# Altium project ControllerPCB.PrjPcb (part 2 of 2)

## Sheet Power.SchDoc
size A3; Date: 01/12/2021; DrawnBy: Can Güveren; SheetNumber: 4; SheetTotal: 4; PageSize: A3
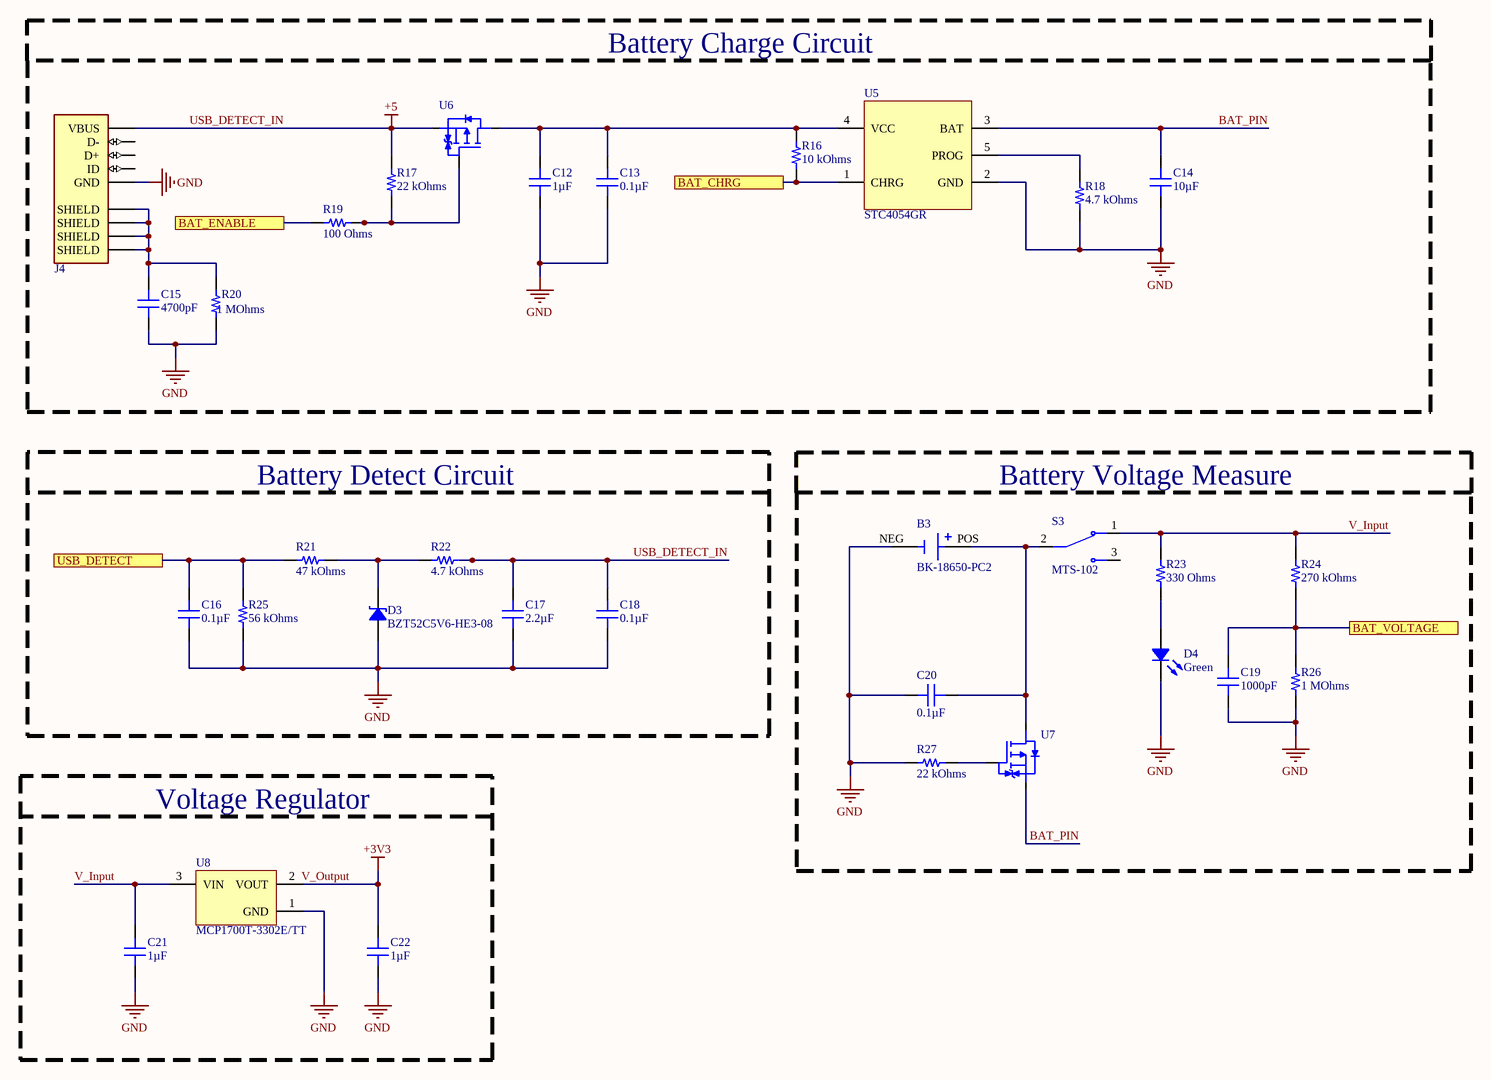
[diagram p3: Power.SchDoc]

### Parts
B3  BK-18650-PC2  [BK-16850-PC2]
C12  1µF  [CAP 0603_1608]
C13  0.1µF  [CAP 0603_1608]
C14  10µF  [CAP 0603_1608]
C15  4700pF  [CAP 0603_1608]
C16  0.1µF  [CAP 0603_1608]
C17  2.2µF  [CAP 0603_1608]
C18  0.1µF  [CAP 0603_1608]
C19  1000pF  [CAP 0603_1608]
C20  0.1µF  [CAP 0603_1608]
C21  1µF  [CAP 0603_1608]
C22  1µF  [CAP 0603_1608]
D3  BZT52C5V6-HE3-08  [SOD-123]
D4  Green  [LED 1206_3216 YELLOW]
J4  USB2066-05-RBHM-15-STB-00-00-A  [USB Mini-B]  (value not drawn)
R16  10 kOhms  [RES 0603_1608]
R17  22 kOhms  [RES 0603_1608]
R18  4.7 kOhms  [RES 0603_1608]
R19  100 Ohms  [RES 0603_1608]
R20  1 MOhms  [RES 0603_1608]
R21  47 kOhms  [RES 0603_1608]
R22  4.7 kOhms  [RES 0603_1608]
R23  330 Ohms  [RES 0603_1608]
R24  270 kOhms  [RES 0603_1608]
R25  56 kOhms  [RES 0603_1608]
R26  1 MOhms  [RES 0603_1608]
R27  22 kOhms  [RES 0603_1608]
S3  MTS-102  [MTS-102 (Toggle)]
U5  STC4054GR  [TSOT-23]
U6  SSM3J338R,LF  [SOT-23-3]  (value not drawn)
U7  SSM3J338R,LF  [SOT-23-3]  (value not drawn)
U8  MCP1700T-3302E/TT  [SOT-23-3]

### Blocks framed on the sheet
Battery Charge Circuit: C12-C15 J4 R16-R20 U5 U6
Battery Detect Circuit: C16-C18 D3 R21 R22 R25
Battery Voltage Measure: B3 C19 C20 D4 R23 R24 R26 R27 S3 U7
Voltage Regulator: C21 C22 U8

### Ports
BAT_CHRG, BAT_ENABLE, BAT_VOLTAGE, USB_DETECT

### Nets
GND: B3.NEG C12.1 C13.1 C14.1 C15.1 C16.1 C17.1 C18.1 C19.1 C20.1 C21.1 C22.1 D3.1 D4.2 J4.5(GND) R18.1 R20.1 R25.1 R26.1 R27.1 U5.2(GND) U8.1(GND)
USB_DETECT_IN: C17.2 C18.2 J4.1(VBUS) R17.2 R22.1 U6.2(S)  [also labelled +5]
V_Output: C22.2 U8.2(VOUT)  [also labelled +3V3]
BAT_PIN: C14.2 U5.3(BAT) U7.2(S)
V_Input: C21.2 R23.2 R24.2 S3.1 U8.3(VIN)
NetB3_POS: B3.POS C20.2 S3.2 U7.3(D)
NetC12_2: C12.2 C13.2 R16.2 U5.4(VCC) U6.3(D)
NetC15_2: C15.2 J4.6(SHIELD) J4.7(SHIELD) J4.8(SHIELD) J4.9(SHIELD) R20.2
NetC16_2: C16.2 R21.1 R25.2 ; port USB_DETECT
NetC19_2: C19.2 R24.1 R26.2 ; port BAT_VOLTAGE
NetD3_2: D3.2 R21.2 R22.2
NetD4_1: D4.1 R23.1
NetR16_1: R16.1 U5.1(CHRG) ; port BAT_CHRG
NetR17_1: R17.1 R19.2 U6.1(G)
NetR18_2: R18.2 U5.5(PROG)
NetR19_1: R19.1 ; port BAT_ENABLE
NetR27_2: R27.2 U7.1(G)

Not connected (* = marked no-connect by the designer): J4 2(D-) 3(D+) 4(ID); S3 3

### Notes on the sheet
- Project Name
- Draw By
- Date
- Size
- Number

### Library data of the parts
B3 = BK-18650-PC2: Battery Holder 18650 Pc Pin; Manufacturer: Memory Protection Devices; Number of Cells: 1; Supplier 1: Digi-Key; Manufacturer Part Number: BK-18650-PC2; RoHS: Yes; Category: Uncategorized; Stock 1: 7372; Pricing 1: 1=3,64000, 10=3,06200, 50=2,68780, 100=2,53120, 250=2,32628, 500=2,18166, 1000=2,03701, 2500=1,84416, 5000=1,66336 (USD); Mount: Through Hole,PCB; Package Quantity: 100; Termination: PC Pin; ComponentLink1URL: https://datasheet.ciiva.com/3/bk-18650-pc2-datasheet-3879.pdf?src-supplier=Digi-Key; ComponentLink1Description: https://datasheet.ciiva.com/3/bk-18650-pc2-datasheet-3879.pdf?src-supplier=Digi-Key; Supplier Part Number 1: BK-18650-PC2-ND
C12 C21 C22 = C0603C105K4RACAUTO: CAP CER 0603 1UF 16V X7R 10%; Manufacturer: KEMET; Part Number: C0603C105K4RACAUTO; Value: 1µF; Applications: Automotive, Bypass, Decoupling; Capacitance: 1µF; ComponentLink1Description: Datasheet; ComponentLink1URL: https://api.kemet.com/component-edge/download/datasheet/C0603C105K4RACAUTO.pdf; ComponentLink2Description: DigiKey Link; ComponentLink2URL: http://digikey.com/product-detail/en/kemet/C0603C105K4RACAUTO/399-17704-1-ND/8635855; Device Package: 0603 (1608 Metric); LastUpdated: 2.09.2020 01:03:36; Lifecycle Status: Active; Minimum Order: 1; Mounting Type: Surface Mount, MLCC; Operating Temperature: -55°C ~ 125°C; Package / Case: 0603 (1608 Metric); Packaging: TapeAndReel; PartId: 2179; Part Status: Active; Price: 0.02; Ratings: AEC-Q200; Series: SMD Auto X7R; Size / Dimension: 0.063" L x 0.031" W (1.60mm x 0.80mm); Supplier 1: DigiKey; Supplier Part Number 1: 399-17704-1-ND; Temperature Coefficient: X7R; Thickness (Max): 0.037" (0.95mm); Tolerance: ±10%; Voltage - Rated: 16V
C13 C16 C18 C20 = 0603Y0160104KXT: CAP CER 0.10UF 16V X7R 0603; Manufacturer: Knowles Syfer; Temperature Coefficient: X7R (2R1); Tolerance: ±10%; Part Number: 0603Y0160104KXT; Value: 0.1µF; Applications: High Reliability, Boardflex Sensitive; Capacitance: 0.1µF; ComponentLink1Description: Datasheet; ComponentLink1URL: https://www.knowlescapacitors.com/getattachment/2dbfc8bc-e2b3-4b4d-afb1-43b011b9ebe0/High-Std-Voltage.aspx; ComponentLink2Description: DigiKey Link; ComponentLink2URL: http://digikey.com/product-detail/en/knowles-syfer/0603Y0160104KXT/1608-1363-1-ND/7644465; Device Package: 0603 (1608 Metric); Features: Soft Termination, High Temperature; LastUpdated: 2.09.2020 01:03:34; Lifecycle Status: Active; Minimum Order: 1; Mounting Type: Surface Mount, MLCC; Operating Temperature: -55°C ~ 125°C; Package / Case: 0603 (1608 Metric); Packaging: TapeAndReel; PartId: 2921; Part Status: Active; Price: 0.16; Series: FlexiCap™; Size / Dimension: 0.063" L x 0.031" W (1.60mm x 0.80mm); Supplier 1: DigiKey; Supplier Part Number 1: 1608-1363-1-ND; Thickness (Max): 0.031" (0.80mm); Voltage - Rated: 16V
C14 = GRM188R60J106ME47D: CAP CER 10UF 6.3V X5R 0603; Manufacturer: Murata Electronics; Tolerance: ±20%; Part Number: GRM188R60J106ME47D; Value: 10µF; Applications: General Purpose; Capacitance: 10µF; ComponentLink1Description: Datasheet; ComponentLink1URL: https://www.murata.com/~/media/webrenewal/support/library/catalog/products/capacitor/mlcc/c02e.ashx?la=en-us; ComponentLink2Description: DigiKey Link; ComponentLink2URL: http://digikey.com/product-detail/en/murata-electronics/GRM188R60J106ME47D/490-3896-1-ND/965938; Device Package: 0603 (1608 Metric); LastUpdated: 2.09.2020 01:03:35; Lifecycle Status: Active; Minimum Order: 1; Mounting Type: Surface Mount, MLCC; Operating Temperature: -55°C ~ 85°C; Package / Case: 0603 (1608 Metric); Packaging: TapeAndReel; PartId: 2351; Part Status: Active; Price: 0.03; Series: GRM; Size / Dimension: 0.063" L x 0.031" W (1.60mm x 0.80mm); Supplier 1: DigiKey; Supplier Part Number 1: 490-3896-1-ND; Temperature Coefficient: X5R; Thickness (Max): 0.035" (0.90mm); Voltage - Rated: 6.3V
C15 = C0603C472K4RECAUTO: CAP CER 0603 4.7NF 16V X7R 10%; Manufacturer: KEMET; Part Number: C0603C472K4RECAUTO; Value: 4700pF; Applications: Automotive, ESD Protection; Capacitance: 4700pF; ComponentLink1Description: Datasheet; ComponentLink1URL: https://api.kemet.com/component-edge/download/datasheet/C0603C472K4RECAUTO.pdf; ComponentLink2Description: DigiKey Link; ComponentLink2URL: http://digikey.com/product-detail/en/kemet/C0603C472K4RECAUTO/399-17879-1-ND/8640546; Device Package: 0603 (1608 Metric); LastUpdated: 2.09.2020 01:03:03; Lifecycle Status: Active; Minimum Order: 1; Mounting Type: Surface Mount, MLCC; Operating Temperature: -55°C ~ 125°C; Package / Case: 0603 (1608 Metric); Packaging: TapeAndReel; PartId: 17340; Part Status: Active; Price: 0.03; Ratings: AEC-Q200; Series: ESD SMD Auto X7R; Size / Dimension: 0.063" L x 0.031" W (1.60mm x 0.80mm); Supplier 1: DigiKey; Supplier Part Number 1: 399-17879-1-ND; Temperature Coefficient: X7R; Thickness (Max): 0.034" (0.87mm); Tolerance: ±10%; Voltage - Rated: 16V
C17 = CC0603ZRY5V7BB225: CAP CER 2.2UF 16V Y5V 0603; Manufacturer: Yageo; Temperature Coefficient: Y5V (F); Tolerance: -20%, +80%; Part Number: CC0603ZRY5V7BB225; Value: 2.2µF; Applications: General Purpose; Capacitance: 2.2µF; ComponentLink1Description: Datasheet; ComponentLink1URL: http://www.yageo.com/documents/recent/UPY-GPHC_Y5V_6.3V-to-50V_8.pdf; ComponentLink2Description: DigiKey Link; ComponentLink2URL: http://digikey.com/product-detail/en/yageo/CC0603ZRY5V7BB225/311-3416-1-ND/7164437; Device Package: 0603 (1608 Metric); LastUpdated: 2.09.2020 01:03:36; Lifecycle Status: Active; Minimum Order: 1; Mounting Type: Surface Mount, MLCC; Operating Temperature: -30°C ~ 85°C; Package / Case: 0603 (1608 Metric); Packaging: TapeAndReel; PartId: 2203; Part Status: Active; Price: 0.02; Series: CC; Size / Dimension: 0.063" L x 0.031" W (1.60mm x 0.80mm); Supplier 1: DigiKey; Supplier Part Number 1: 311-3416-1-ND; Thickness (Max): 0.035" (0.90mm); Voltage - Rated: 16V
C19 = C0603C102K4RECAUTO: CAP CER 0603 1NF 16V X7R 10%; Manufacturer: KEMET; Part Number: C0603C102K4RECAUTO; Value: 1000pF; Applications: Automotive, ESD Protection; Capacitance: 1000pF; ComponentLink1Description: Datasheet; ComponentLink1URL: https://api.kemet.com/component-edge/download/datasheet/C0603C102K4RECAUTO.pdf; ComponentLink2Description: DigiKey Link; ComponentLink2URL: http://digikey.com/product-detail/en/kemet/C0603C102K4RECAUTO/399-17878-1-ND/8640545; Device Package: 0603 (1608 Metric); LastUpdated: 2.09.2020 01:03:36; Lifecycle Status: Active; Minimum Order: 1; Mounting Type: Surface Mount, MLCC; Operating Temperature: -55°C ~ 125°C; Package / Case: 0603 (1608 Metric); Packaging: TapeAndReel; PartId: 2316; Part Status: Active; Price: 0.02; Ratings: AEC-Q200; Series: ESD SMD Auto X7R; Size / Dimension: 0.063" L x 0.031" W (1.60mm x 0.80mm); Supplier 1: DigiKey; Supplier Part Number 1: 399-17878-1-ND; Temperature Coefficient: X7R; Thickness (Max): 0.034" (0.87mm); Tolerance: ±10%; Voltage - Rated: 16V
D3 = BZT52C5V6-HE3-08: DIODE ZENER 5.6V 410MW SOD123; Manufacturer: Vishay Semiconductor Diodes Division; Current - Reverse Leakage @ Vr: 100nA @ 1V; Impedance (Max) (Zzt): 10 Ohms; Tolerance: ±5%; Part Number: BZT52C5V6-HE3-08; ComponentLink1Description: Datasheet; ComponentLink1URL: http://www.vishay.com/docs/85760/bzt52.pdf; ComponentLink2Description: DigiKey Link; ComponentLink2URL: http://digikey.com/product-detail/en/vishay-semiconductor-diodes-division/BZT52C5V6-HE3-08/BZT52C5V6-HE3-08GICT-ND/8564836; LastUpdated: 2.09.2020 01:19:27; Lifecycle Status: Active; Minimum Order: 1; Mounting Type: Surface Mount; Operating Temperature: -55°C ~ 150°C; Package / Case: SOD-123; Packaging: TapeAndReel; PartId: 1739; Part Status: Active; Power - Max: 410mW; Price: 0.05; Series: Automotive, AEC-Q101; Supplier 1: DigiKey; Supplier Part Number 1: BZT52C5V6-HE3-08GICT-ND; Supplier Device Package: SOD-123; Voltage - Zener (Nom) (Vz): 5.6V
D4 = 5990240007F: LED YELLOW 1206 SMD; Manufacturer: Dialight; Configuration: Standard; Current - Test: 20mA; Lens Color: 0.80mm; Lens Size: 2.00mm x 1.60mm; Lens Style: Rectangle with Flat Top; Millicandela Rating: 126mcd; Viewing Angle: 140°; Voltage - Forward (Vf) (Typ): 2.1V; Wavelength - Dominant: 590nm; Part Number: 5990240007F; Color: Yellow; ComponentLink1Description: Datasheet; ComponentLink1URL: http://www.dialightsignalsandcomponents.com/Assets/Brochures_And_Catalogs/Indication/CBI_SMD_new/Dialight_CBI_data_599-1206_Apr2018.pdf; ComponentLink2Description: DigiKey Link; ComponentLink2URL: http://digikey.com/product-detail/en/dialight/5990240007F/350-4363-1-ND/9385469; Device Package: 1206 (3216 Metric); Height (Max): 0.80mm; LastUpdated: 2.09.2020 01:21:26; Lifecycle Status: Active; Minimum Order: 1; Mounting Type: Surface Mount; Package / Case: 1206 (3216 Metric); Packaging: TapeAndReel; PartId: 1; Part Status: Active; Price: 0.07; Series: 599; Size / Dimension: 3.20mm L x 1.60mm W; Supplier 1: DigiKey; Supplier Part Number 1: 350-4363-1-ND; Supplier Device Package: 1206; Value: Green
J4 = USB2066-05-RBHM-15-STB-00-00-A: Conn Mini USB Type B RCP 5 POS 0.8mm Solder RA SMD 5 Terminal 1 Port T/R; Manufacturer: GCT (GLOBAL CONNECTOR TECHNOLOGY); Supplier 1: Newark; Manufacturer Part Number: USB2066-05-RBHM-15-STB-00-00-A; RoHS: No; ComponentLink1URL: http://www.farnell.com/datasheets/2342959.pdf?src-supplier=Farnell; ComponentLink1Description: http://www.farnell.com/datasheets/2342959.pdf?src-supplier=Farnell; ComponentLink2URL: http://www.farnell.com/datasheets/2342959.pdf?src-supplier=Newark; ComponentLink2Description: http://www.farnell.com/datasheets/2342959.pdf?src-supplier=Newark; Supplier Part Number 1: 28X2565
R16 = CPF0603B10KE: RES SMD 10K OHM 0.1% 1/16W 0603; Manufacturer: TE Connectivity Passive Product; Power (Watts): 0.063W, 1/16W; Temperature Coefficient: ±25ppm/°C; Part Number: CPF0603B10KE; Value: 10 kOhms; ComponentLink1Description: Datasheet; ComponentLink1URL: https://www.te.com/commerce/DocumentDelivery/DDEController?Action=srchrtrv&DocNm=1773200&DocType=DS&DocLang=English; ComponentLink2Description: DigiKey Link; ComponentLink2URL: http://digikey.com/product-detail/en/te-connectivity-passive-product/CPF0603B10KE/A119886CT-ND/4966484; Composition: Thin Film; Device Package: 0603 (1608 Metric); Height - Seated (Max): 0.022" (0.55mm); LastUpdated: 2.09.2020 01:10:25; Lifecycle Status: Active; Minimum Order: 1; Number of Terminations: 2; Operating Temperature: -55°C ~ 155°C; Package / Case: 0603 (1608 Metric); Packaging: TapeAndReel; PartId: 4872; Part Status: Active; Price: 0.09; Resistance: 10 kOhms; Series: CPF, Neohm; Size / Dimension: 0.061" L x 0.031" W (1.55mm x 0.80mm); Supplier 1: DigiKey; Supplier Part Number 1: A119886CT-ND; Supplier Device Package: 0603; Tolerance: ±0.1%
R17 R27 = AC0603JR-0722KL: RES SMD 22K OHM 5% 1/10W 0603; Manufacturer: Yageo; Power (Watts): 0.1W, 1/10W; Temperature Coefficient: ±100ppm/°C; Part Number: AC0603JR-0722KL; Value: 22 kOhms; ComponentLink1Description: Datasheet; ComponentLink1URL: https://www.yageo.com/upload/media/product/productsearch/datasheet/rchip/PYu-AC_51_RoHS_L_7.pdf; ComponentLink2Description: DigiKey Link; ComponentLink2URL: http://digikey.com/product-detail/en/yageo/AC0603JR-0722KL/YAG3653CT-ND/6006502; Composition: Thick Film; Device Package: 0603 (1608 Metric); Features: Automotive AEC-Q200, Moisture Resistant; Height - Seated (Max): 0.022" (0.55mm); LastUpdated: 2.09.2020 01:10:18; Lifecycle Status: Active; Minimum Order: 1; Number of Terminations: 2; Operating Temperature: -55°C ~ 155°C; Package / Case: 0603 (1608 Metric); Packaging: CutTape; PartId: 8286; Part Status: Active; Price: 0.10; Ratings: AEC-Q200; Resistance: 22 kOhms; Series: AC; Size / Dimension: 0.063" L x 0.031" W (1.60mm x 0.80mm); Supplier 1: DigiKey; Supplier Part Number 1: YAG3653CT-ND; Supplier Device Package: 0603; Tolerance: ±5%
R18 R22 = ERA-3AEB472V: RES SMD 4.7K OHM 0.1% 1/10W 0603; Manufacturer: Panasonic Electronic Components; Power (Watts): 0.1W, 1/10W; Temperature Coefficient: ±25ppm/°C; Part Number: ERA-3AEB472V; Value: 4.7 kOhms; ComponentLink1Description: Datasheet; ComponentLink1URL: https://industrial.panasonic.com/cdbs/www-data/pdf/RDM0000/AOA0000C307.pdf; ComponentLink2Description: DigiKey Link; ComponentLink2URL: http://digikey.com/product-detail/en/panasonic-electronic-components/ERA-3AEB472V/P4.7KDBCT-ND/1466068; Composition: Thin Film; Device Package: 0603 (1608 Metric); Features: Automotive AEC-Q200; Height - Seated (Max): 0.022" (0.55mm); LastUpdated: 2.09.2020 01:10:23; Lifecycle Status: Active; Minimum Order: 1; Number of Terminations: 2; Operating Temperature: -55°C ~ 155°C; Package / Case: 0603 (1608 Metric); Packaging: TapeAndReel; PartId: 5519; Part Status: Active; Price: 0.04; Ratings: AEC-Q200; Resistance: 4.7 kOhms; Series: ERA-3A; Size / Dimension: 0.063" L x 0.031" W (1.60mm x 0.80mm); Supplier 1: DigiKey; Supplier Part Number 1: P4.7KDBCT-ND; Supplier Device Package: 0603; Tolerance: ±0.1%
R19 = RNCS0603BKE100R: RES 100 OHM 0.1% 1/16W 0603; Manufacturer: Stackpole Electronics Inc; Power (Watts): 0.063W, 1/16W; Temperature Coefficient: ±25ppm/°C; Part Number: RNCS0603BKE100R; Value: 100 Ohms; ComponentLink1Description: Datasheet; ComponentLink1URL: https://www.seielect.com/catalog/sei-rncs_rnch.pdf; ComponentLink2Description: DigiKey Link; ComponentLink2URL: http://digikey.com/product-detail/en/stackpole-electronics-inc/RNCS0603BKE100R/RNCS0603BKE100RCT-ND/1800117; Composition: Thin Film; Device Package: 0603 (1608 Metric); Features: Anti-Corrosive, Automotive AEC-Q200, Moisture Resistant; Height - Seated (Max): 0.022" (0.55mm); LastUpdated: 2.09.2020 01:10:25; Lifecycle Status: Active; Minimum Order: 1; Number of Terminations: 2; Operating Temperature: -55°C ~ 155°C; Package / Case: 0603 (1608 Metric); Packaging: TapeAndReel; PartId: 4839; Part Status: Active; Price: 0.08; Ratings: AEC-Q200; Resistance: 100 Ohms; Series: RNCS; Size / Dimension: 0.061" L x 0.031" W (1.55mm x 0.80mm); Supplier 1: DigiKey; Supplier Part Number 1: RNCS0603BKE100RCT-ND; Supplier Device Package: 0603; Tolerance: ±0.1%
R20 R26 = RMCF0603FT1M00: RES 1M OHM 1% 1/10W 0603; Manufacturer: Stackpole Electronics Inc; Power (Watts): 0.1W, 1/10W; Temperature Coefficient: ±100ppm/°C; Part Number: RMCF0603FT1M00; Value: 1 MOhms; ComponentLink1Description: Datasheet; ComponentLink1URL: https://www.seielect.com/catalog/sei-rmcf_rmcp.pdf; ComponentLink2Description: DigiKey Link; ComponentLink2URL: http://digikey.com/product-detail/en/stackpole-electronics-inc/RMCF0603FT1M00/RMCF0603FT1M00CT-ND/1943143; Composition: Thick Film; Device Package: 0603 (1608 Metric); Features: Automotive AEC-Q200; Height - Seated (Max): 0.022" (0.55mm); LastUpdated: 2.09.2020 01:10:22; Lifecycle Status: Active; Minimum Order: 1; Number of Terminations: 2; Operating Temperature: -55°C ~ 155°C; Package / Case: 0603 (1608 Metric); Packaging: CutTape; PartId: 6074; Part Status: Active; Price: 0.10; Ratings: AEC-Q200; Resistance: 1 MOhms; Series: RMCF; Size / Dimension: 0.061" L x 0.031" W (1.55mm x 0.80mm); Supplier 1: DigiKey; Supplier Part Number 1: RMCF0603FT1M00CT-ND; Supplier Device Package: 0603; Tolerance: ±1%
R21 = RCS060347K0JNEA: RES SMD 47K OHM 5% 1/4W 0603; Manufacturer: Vishay Dale; Power (Watts): 0.25W, 1/4W; Temperature Coefficient: ±200ppm/°C; Part Number: RCS060347K0JNEA; Value: 47 kOhms; ComponentLink1Description: Datasheet; ComponentLink1URL: http://www.vishay.com/docs/20065/rcse3.pdf; ComponentLink2Description: DigiKey Link; ComponentLink2URL: http://digikey.com/product-detail/en/vishay-dale/RCS060347K0JNEA/541-2819-1-ND/5867112; Composition: Thick Film; Device Package: 0603 (1608 Metric); Features: Automotive AEC-Q200, Pulse Withstanding; Height - Seated (Max): 0.020" (0.50mm); LastUpdated: 2.09.2020 01:10:23; Lifecycle Status: Active; Minimum Order: 1; Number of Terminations: 2; Operating Temperature: -55°C ~ 155°C; Package / Case: 0603 (1608 Metric); Packaging: TapeAndReel; PartId: 5445; Part Status: Active; Price: 0.02; Ratings: AEC-Q200; Resistance: 47 kOhms; Series: RCS e3; Size / Dimension: 0.061" L x 0.033" W (1.55mm x 0.85mm); Supplier 1: DigiKey; Supplier Part Number 1: 541-2819-1-ND; Supplier Device Package: 0603; Tolerance: ±5%
R23 = AC0603FR-07330RL: RES SMD 330 OHM 1% 1/10W 0603; Manufacturer: Yageo; Power (Watts): 0.1W, 1/10W; Temperature Coefficient: ±100ppm/°C; Part Number: AC0603FR-07330RL; Value: 330 Ohms; ComponentLink1Description: Datasheet; ComponentLink1URL: https://www.yageo.com/upload/media/product/productsearch/datasheet/rchip/PYu-AC_51_RoHS_L_7.pdf; ComponentLink2Description: DigiKey Link; ComponentLink2URL: http://digikey.com/product-detail/en/yageo/AC0603FR-07330RL/YAG3595CT-ND/6006444; Composition: Thick Film; Device Package: 0603 (1608 Metric); Features: Automotive AEC-Q200, Moisture Resistant; Height - Seated (Max): 0.022" (0.55mm); LastUpdated: 2.09.2020 01:09:46; Lifecycle Status: Active; Minimum Order: 1; Number of Terminations: 2; Operating Temperature: -55°C ~ 155°C; Package / Case: 0603 (1608 Metric); Packaging: CutTape; PartId: 22572; Part Status: Active; Price: 0.10; Ratings: AEC-Q200; Resistance: 330 Ohms; Series: AC; Size / Dimension: 0.063" L x 0.031" W (1.60mm x 0.80mm); Supplier 1: DigiKey; Supplier Part Number 1: YAG3595CT-ND; Supplier Device Package: 0603; Tolerance: ±1%
R24 = CRGP0603F270K: CRGP 0603 270K 1%; Manufacturer: TE Connectivity Passive Product; Power (Watts): 0.25W, 1/4W; Temperature Coefficient: ±100ppm/°C; Part Number: CRGP0603F270K; Value: 270 kOhms; ComponentLink1Description: Datasheet; ComponentLink1URL: https://www.te.com/commerce/DocumentDelivery/DDEController?Action=srchrtrv&DocNm=9-1773463-9&DocType=DS&DocLang=English; ComponentLink2Description: DigiKey Link; ComponentLink2URL: http://digikey.com/product-detail/en/te-connectivity-passive-product/CRGP0603F270K/A130445CT-ND/8578277; Composition: Thick Film; Device Package: 0603 (1608 Metric); Features: Pulse Withstanding; Height - Seated (Max): 0.022" (0.55mm); LastUpdated: 2.09.2020 01:10:24; Lifecycle Status: Active; Minimum Order: 1; Number of Terminations: 2; Operating Temperature: -55°C ~ 155°C; Package / Case: 0603 (1608 Metric); Packaging: TapeAndReel; PartId: 5021; Part Status: Active; Price: 0.02; Resistance: 270 kOhms; Series: CRGP; Size / Dimension: 0.063" L x 0.031" W (1.60mm x 0.80mm); Supplier 1: DigiKey; Supplier Part Number 1: A130445CT-ND; Supplier Device Package: 0603; Tolerance: ±1%
R25 = AC0603FR-0756KL: RES SMD 56K OHM 1% 1/10W 0603; Manufacturer: Yageo; Power (Watts): 0.1W, 1/10W; Temperature Coefficient: ±100ppm/°C; Part Number: AC0603FR-0756KL; Value: 56 kOhms; ComponentLink1Description: Datasheet; ComponentLink1URL: https://www.yageo.com/upload/media/product/productsearch/datasheet/rchip/PYu-AC_51_RoHS_L_7.pdf; ComponentLink2Description: DigiKey Link; ComponentLink2URL: http://digikey.com/product-detail/en/yageo/AC0603FR-0756KL/YAG3619CT-ND/6006468; Composition: Thick Film; Device Package: 0603 (1608 Metric); Features: Automotive AEC-Q200, Moisture Resistant; Height - Seated (Max): 0.022" (0.55mm); LastUpdated: 2.09.2020 01:09:58; Lifecycle Status: Active; Minimum Order: 1; Number of Terminations: 2; Operating Temperature: -55°C ~ 155°C; Package / Case: 0603 (1608 Metric); Packaging: CutTape; PartId: 17472; Part Status: Active; Price: 0.10; Ratings: AEC-Q200; Resistance: 56 kOhms; Series: AC; Size / Dimension: 0.063" L x 0.031" W (1.60mm x 0.80mm); Supplier 1: DigiKey; Supplier Part Number 1: YAG3619CT-ND; Supplier Device Package: 0603; Tolerance: ±1%
U5 = STC4054GR: STC4054 Series 6.5 V 800 mA Standalone Linear Li-Ion Battery Charger - TSOT-23-5; Manufacturer: STMicroelectronics; Output Voltage: 4.2V; Min Supply Voltage: 4.25V; Max Supply Voltage: 6.5V; Output Current: 800mA; Supplier 1: Digi-Key; Manufacturer Part Number: STC4054GR; RoHS: Yes; Category: Battery Management; Stock 1: 8928; Pricing 1: 1=1,66000, 10=1,49200, 25=1,40800, 100=1,19960, 250=1,12636, 500=0,98556, 1000=0,92978 (USD); Mount: Surface Mount; Case/Package: SOT-23-5; Number of Pins: 23; Contact Plating: Gold; Min Operating Temperature: -40°C; Max Operating Temperature: 85°C; Packaging: Tape and Reel; Package Quantity: 1; Max Input Voltage: 6.5V; Min Input Voltage: 4.2V; Max Output Current: 800mA; Series: -; Radiation Hardening: No; Lead Free: Lead Free; RoHS Compliant: Yes; ComponentLink1URL: https://datasheet.ciiva.com/4874/cd00132951-98930-4874537.pdf?src-supplier=Mouser; ComponentLink1Description: https://datasheet.ciiva.com/4874/cd00132951-98930-4874537.pdf?src-supplier=Mouser; ComponentLink2URL: https://datasheet.ciiva.com/17299/cd00132951-17299245.pdf?src-supplier=Avnet+Europe; ComponentLink2Description: https://datasheet.ciiva.com/17299/cd00132951-17299245.pdf?src-supplier=Avnet+Europe; ComponentLink3URL: https://datasheet.ciiva.com/1934/cd00132951-1934403.pdf?src-supplier=Digi-Key; ComponentLink3Description: https://datasheet.ciiva.com/1934/cd00132951-1934403.pdf?src-supplier=Digi-Key; ComponentLink4URL: https://datasheet.ciiva.com/1934/cd00132951-1934404.pdf?src-supplier=Digi-Key; ComponentLink4Description: https://datasheet.ciiva.com/1934/cd00132951-1934404.pdf?src-supplier=Digi-Key; ComponentLink5URL: https://datasheet.ciiva.com/1934/cd00132951-1934405.pdf?src-supplier=Digi-Key; ComponentLink5Description: https://datasheet.ciiva.com/1934/cd00132951-1934405.pdf?src-supplier=Digi-Key; ComponentLink6URL: https://datasheet.ciiva.com/3213/cd00132951-3213446.pdf?src-supplier=Avnet; ComponentLink6Description: https://datasheet.ciiva.com/3213/cd00132951-3213446.pdf?src-supplier=Avnet; Supplier Part Number 1: 497-5809-1-ND
U6 U7 = SSM3J338R,LF: Small-Signal Mosfet Pch Sot23F, Vdss=-12V, Id=-6A, Rdson: 20Ohm Rohs Compliant: Yes; Manufacturer: Toshiba; Drain to Source Voltage (Vdss): 12V; Continuous Drain Current (ID): 6A; Rds On Max: 17.6mR; Input Capacitance: 1.4nF; Max Power Dissipation: 1W; Supplier 1: Digi-Key; Manufacturer Part Number: SSM3J338R,LF; RoHS: Yes; Category: MOSFETs; Pricing 1: 1=0,38000, 10=0,31000, 100=0,21120, 500=0,15840, 1000=0,11880 (USD); Mount: Surface Mount; Case/Package: SOT-23-3; Packaging: Tape and Reel; RoHS Compliant: Yes; ComponentLink1URL: http://www.mouser.com/ds/2/408/SSM3J338R_datasheet_en_20150831-805928.pdf?src-supplier=Mouser; ComponentLink1Description: http://www.mouser.com/ds/2/408/SSM3J338R_datasheet_en_20150831-805928.pdf?src-supplier=Mouser; ComponentLink2URL: http://toshiba.semicon-storage.com/info/docget.jsp?did=30384&prodName=SSM3J338R&src-supplier=Digi-Key; ComponentLink2Description: http://toshiba.semicon-storage.com/info/docget.jsp?did=30384&prodName=SSM3J338R&src-supplier=Digi-Key
U8 = MCP1700T-3302E/TT: Pwr Sply Func, Voltage Regulator, LDO, SOT-23, PD 369.6mW, VO 3.3V, Regline +/-0.75%/V; Manufacturer: Microchip; Number of Outputs: 1; Min Input Voltage: 2.3V; Max Input Voltage: 6V; Dropout Voltage: 178mV; Output Current: 250mA; Input Bias Current: 1.6uA; Polarity: Positive; Quiescent Current: 4uA; Accuracy: 2%; Output Type: Fixed; Supplier 1: Digi-Key; Manufacturer Part Number: MCP1700T-3302E/TT; RoHS: Yes; Category: Voltage Regulators - Linear; Pricing 1: 1=0,46000, 25=0,38160, 100=0,34500 (USD); Mount: Surface Mount; Case/Package: SOT-23; Number of Pins: 3; Contact Plating: Tin,Matte; Min Operating Temperature: -40°C; Max Operating Temperature: 125°C; Nominal Output Voltage: 3.3V; Packaging: Tape and Reel; Output Voltage: 3.3V; Max Output Current: 250mA; Max Supply Voltage: 6V; Min Supply Voltage: 2.3V; Package Quantity: 3000; Max Power Dissipation: 369.6mW; Min Output Voltage: 3.3V; Max Output Voltage: 3.3V; Termination: SMD/SMT; Output Voltage Accuracy: 2%; Nominal Supply Current: 4uA; Power Dissipation: 369.6mW; Length: 2.9mm; Width: 1.3mm; Height: 0.95mm; Radiation Hardening: No; REACH SVHC: No SVHC; Lead Free: Lead Free; ComponentLink1URL: https://datasheet.ciiva.com/2040/21826b-2040112.pdf?src-supplier=Digi-Key; ComponentLink1Description: https://datasheet.ciiva.com/2040/21826b-2040112.pdf?src-supplier=Digi-Key; ComponentLink2URL: https://datasheet.ciiva.com/5801/1784514-5801824.pdf?src-supplier=Farnell; ComponentLink2Description: https://datasheet.ciiva.com/5801/1784514-5801824.pdf?src-supplier=Farnell; ComponentLink3URL: https://datasheet.ciiva.com/2040/21826b-2040113.pdf?src-supplier=Digi-Key; ComponentLink3Description: https://datasheet.ciiva.com/2040/21826b-2040113.pdf?src-supplier=Digi-Key; ComponentLink4URL: https://datasheet.ciiva.com/2040/21826b-2040114.pdf?src-supplier=Digi-Key; ComponentLink4Description: https://datasheet.ciiva.com/2040/21826b-2040114.pdf?src-supplier=Digi-Key; ComponentLink5URL: https://datasheet.ciiva.com/3224/jp011779-3224133.pdf?src-supplier=Avnet; ComponentLink5Description: https://datasheet.ciiva.com/3224/jp011779-3224133.pdf?src-supplier=Avnet; ComponentLink6URL: https://datasheet.ciiva.com/7649/1784514-7649813.pdf?src-supplier=Element14; ComponentLink6Description: https://datasheet.ciiva.com/7649/1784514-7649813.pdf?src-supplier=Element14; ComponentLink7URL: https://datasheet.ciiva.com/15200/getdatasheetpartid-453599-15200229.pdf?src-supplier=Verical; ComponentLink7Description: https://datasheet.ciiva.com/15200/getdatasheetpartid-453599-15200229.pdf?src-supplier=Verical; ComponentLink8URL: https://datasheet.ciiva.com/17364/jp011779-17364263.pdf?src-supplier=Avnet+Europe; ComponentLink8Description: https://datasheet.ciiva.com/17364/jp011779-17364263.pdf?src-supplier=Avnet+Europe; ComponentLink9URL: https://datasheet.ciiva.com/14150/mcp1700-eng-tds-14150122.pdf?src-supplier=Distrelec; ComponentLink9Description: https://datasheet.ciiva.com/14150/mcp1700-eng-tds-14150122.pdf?src-supplier=Distrelec; ComponentLink10URL: https://datasheet.ciiva.com/22710/1784514-22710988.pdf?src-supplier=Element14; ComponentLink10Description: https://datasheet.ciiva.com/22710/1784514-22710988.pdf?src-supplier=Element14; ComponentLink11URL: https://datasheet.ciiva.com/8041/1784514-8041598.pdf?src-supplier=Element14; ComponentLink11Description: https://datasheet.ciiva.com/8041/1784514-8041598.pdf?src-supplier=Element14; ComponentLink12URL: https://datasheet.ciiva.com/16208/filehandler-aspxddocname-en011779-16208911.pdf?src-supplier=Future+Electronics; ComponentLink12Description: https://datasheet.ciiva.com/16208/filehandler-aspxddocname-en011779-16208911.pdf?src-supplier=Future+Electronics; ComponentLink13URL: https://datasheet.ciiva.com/29305/651414-da-01-en-ic-reg-ld-mcp1700t-3302e-tt-sot-23-3-mcp-29305258.pdf?src-supplier=Conrad; ComponentLink13Description: https://datasheet.ciiva.com/29305/651414-da-01-en-ic-reg-ld-mcp1700t-3302e-tt-sot-23-3-mcp-29305258.pdf?src-supplier=Conrad; Supplier Part Number 1: MCP1700T3302ETTCT-ND
S3 = MTS-102: ComponentLink1URL: https://datasheet.ciiva.com/24455/t111597-24455739.pdf?src-supplier=Onlinecomponents.com; ComponentLink1Description: https://datasheet.ciiva.com/24455/t111597-24455739.pdf?src-supplier=Onlinecomponents.com; ComponentLink2URL: https://datasheet.ciiva.com/2905/t111597-2905494.pdf?src-supplier=Digi-Key; ComponentLink2Description: https://datasheet.ciiva.com/2905/t111597-2905494.pdf?src-supplier=Digi-Key

## Nets that join several sheets
GND: MCU (13 pins), Peripheral (24 pins), Power (22 pins)
V_Output: MCU (15 pins), Peripheral (23 pins), Power (C22.2 U8.2)
I2C1_SCL: MCU (R4.1 U1.42), Peripheral (U4.3)
I2C1_SDA: MCU (R5.1 U1.43), Peripheral (U4.4)
I2C2_SCL: MCU (R6.1 U1.26), Peripheral (U2.4)
I2C2_SDA: MCU (R7.1 U1.27), Peripheral (U2.6)
NetC8_2: MCU (U1.21), Peripheral (C8.2 R8.2)
NetC10_2: MCU (U1.22), Peripheral (C10.2 R10.2)
NetC16_2: MCU (U1.29), Power (C16.2 R21.1 R25.2)
NetC19_2: MCU (U1.19), Power (C19.2 R24.1 R26.2)
NetH1_2: MCU (U1.31), Peripheral (H1.2)
NetH1_3: MCU (U1.30), Peripheral (H1.3)
NetJ2_H2: MCU (U1.11), Peripheral (J2.H2)
NetJ2_V2: MCU (U1.10), Peripheral (J2.V2)
NetJ3_H2: MCU (U1.13), Peripheral (J3.H2)
NetJ3_V2: MCU (U1.12), Peripheral (J3.V2)
NetR14_1: MCU (U1.39), Peripheral (R14.1)
NetR15_1: MCU (U1.38), Peripheral (R15.1)
NetR16_1: MCU (U1.32), Power (R16.1 U5.1)
NetR19_1: MCU (U1.33), Power (R19.1)
NetR28_1: MCU (U1.2), Peripheral (R28.1)
NetR29_1: MCU (U1.25), Peripheral (R29.1)
NetS1_2: MCU (U1.40), Peripheral (S1.2)
NetS2_2: MCU (U1.41), Peripheral (S2.2)
NetU1_14: MCU (U1.14), Peripheral (VR1.2)
NetU1_15: MCU (U1.15), Peripheral (U3.5)
NetU1_16: MCU (U1.16), Peripheral (U3.7)
NetU1_17: MCU (U1.17), Peripheral (U3.6)
NetU1_18: MCU (U1.18), Peripheral (VR2.2)
NetU1_45: MCU (U1.45), Peripheral (U3.4)
NetU1_46: MCU (U1.46), Peripheral (U3.3)